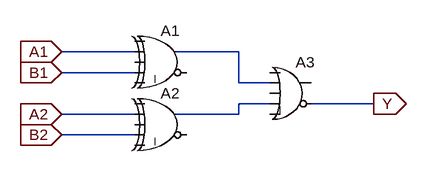
[diagram p0: schematic comparator.asc]
comparator.asc, the LTspice schematic file:
Version 4
SHEET 1 880 680
WIRE 112 96 0 96
WIRE 272 96 176 96
WIRE 112 128 0 128
WIRE 272 144 272 96
WIRE 320 144 272 144
WIRE 320 176 272 176
WIRE 480 176 384 176
WIRE 112 192 0 192
WIRE 272 192 272 176
WIRE 272 192 176 192
WIRE 112 224 0 224
FLAG 0 96 A1
IOPIN 0 96 In
FLAG 0 128 B1
IOPIN 0 128 In
FLAG 0 192 A2
IOPIN 0 192 In
FLAG 0 224 B2
IOPIN 0 224 In
FLAG 480 176 Y
IOPIN 480 176 Out
SYMBOL Digital\\xor 160 48 R0
SYMATTR InstName A1
SYMBOL Digital\\xor 160 144 R0
SYMATTR InstName A2
SYMBOL Digital\\or 352 96 R0
SYMATTR InstName A3

The netlist it stands for:
* comparator.asc
A1 0 A1 0 B1 0 0 N001 0 XOR
A2 0 A2 0 B2 0 0 N002 0 XOR
A3 0 N001 0 N002 0 Y 0 0 OR
.backanno
.end